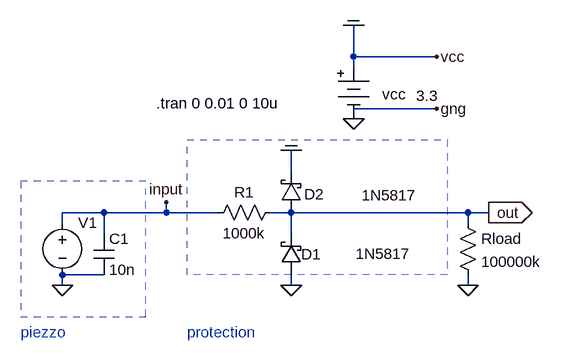
[diagram p0: schematic piezzo protection - Copy.asc]
piezzo protection - Copy.asc, the LTspice schematic file:
Version 4
SHEET 1 880 680
WIRE 240 -64 240 -112
WIRE 368 -64 240 -64
WIRE 240 -48 240 -64
WIRE 368 16 240 16
WIRE 144 112 144 80
WIRE -144 176 -208 176
WIRE -48 176 -48 160
WIRE -48 176 -144 176
WIRE 32 176 -48 176
WIRE 144 176 112 176
WIRE 416 176 144 176
WIRE 448 176 416 176
WIRE -208 192 -208 176
WIRE 416 192 416 176
WIRE -144 208 -144 176
WIRE 144 208 144 176
WIRE -144 272 -208 272
WIRE -208 288 -208 272
WIRE 144 288 144 272
WIRE 416 288 416 272
FLAG -208 288 0
FLAG 144 288 0
FLAG 416 288 0
FLAG 448 176 out
IOPIN 448 176 Out
FLAG -48 160 input
FLAG 240 32 0
FLAG 240 -112 COM
FLAG 144 80 COM
FLAG 368 -64 vcc
FLAG 368 16 gng
SYMBOL schottky 160 272 R180
WINDOW 0 -30 32 Left 2
WINDOW 3 -168 33 Left 2
SYMATTR InstName D1
SYMATTR Value 1N5817
SYMATTR Description Diode
SYMATTR Type diode
SYMBOL res 16 192 R270
WINDOW 0 32 56 VTop 2
WINDOW 3 0 56 VBottom 2
SYMATTR InstName R1
SYMATTR Value 1000k
SYMBOL voltage -208 176 R0
WINDOW 3 24 96 Invisible 2
WINDOW 123 0 0 Left 2
WINDOW 39 0 0 Left 2
SYMATTR Value SINE(2 2 400 0 0 0 0)
SYMATTR InstName V1
SYMBOL res 400 176 R0
SYMATTR InstName Rload
SYMATTR Value 100000k
SYMBOL Misc\\battery 240 -64 R0
WINDOW 0 44 58 Left 2
WINDOW 3 96 60 Left 2
WINDOW 123 0 0 Left 2
WINDOW 39 0 0 Left 2
SYMATTR InstName vcc
SYMATTR Value 3.3
SYMBOL schottky 160 176 R180
WINDOW 0 -35 28 Left 2
WINDOW 3 -177 27 Left 2
SYMATTR InstName D2
SYMATTR Value 1N5817
SYMATTR Description Diode
SYMATTR Type diode
SYMBOL cap -160 208 R0
SYMATTR InstName C1
SYMATTR Value 10n
TEXT -64 8 Left 2 !.tran 0 0.01 0 10u
TEXT -272 360 Left 2 ;piezzo
TEXT -16 360 Left 2 ;protection
RECTANGLE Normal -272 336 -80 128 2
RECTANGLE Normal 384 272 -16 64 2

The netlist it stands for:
* piezzo protection - Copy.asc
D1 0 out 1N5817
R1 input out 1000k
V1 input 0 SINE(2 2 400 0 0 0 0)
Rload out 0 100000k
vcc vcc 0 3.3
D2 out vcc 1N5817
C1 input 0 10n
.model D D
.lib standard.dio
.tran 0 0.01 0 10u
* piezzo
* protection
.backanno
.end

* Results of the author's LTspice run, read from the files saved beside the schematic
* Operating Point, zero values left out:
*   V(out) = 1.98 V
*   V(input) = 2 V
*   V(vcc) = 3.3 V
*   I(D2) = -31.7 µA
*   I(D1) = -31.7 µA
*   I(Rload) = 19.8 nA
*   I(R1) = 19.8 nA
*   I(Vcc) = -31.7 µA
*   I(V1) = -19.8 nA
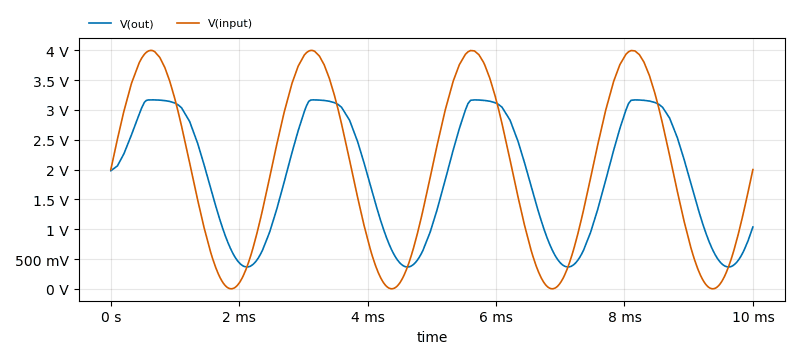
[diagram p1: Transient Analysis of piezzo protection - Copy.asc, plotted from the saved traces]
* Transient Analysis, 1 run:
*   V(out): min 366.5 mV, max 3.169 V, average 1.9 V, rms 2.167 V, last 1.037 V
*   V(input): min 338.4 µV, max 4 V, average 1.998 V, rms 2.45 V, last 2 V